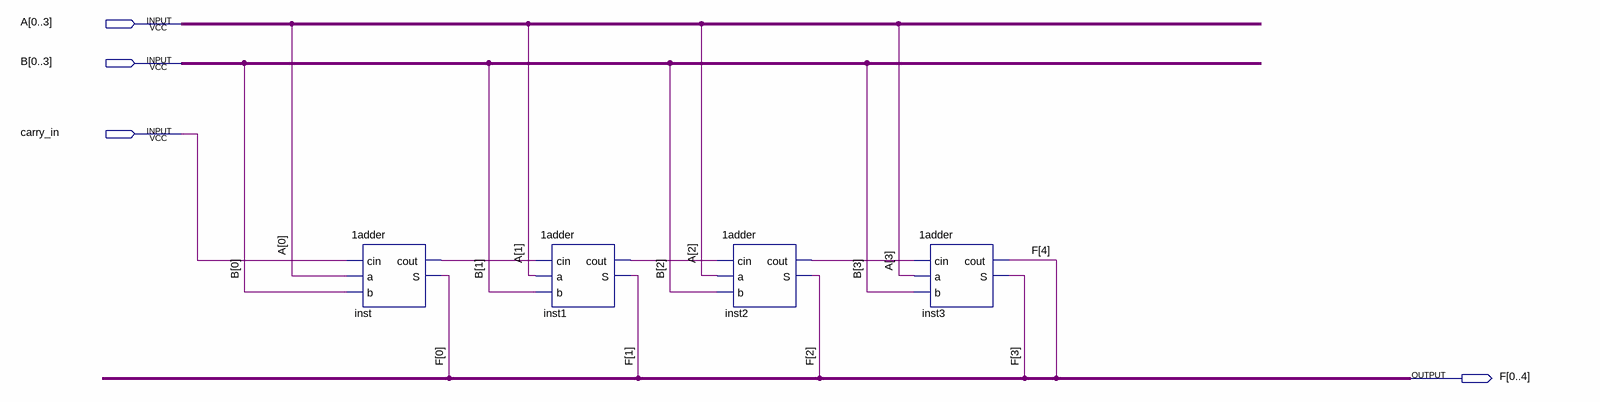
[diagram p0: schematic sheet]
// Quartus schematic 4adder.bdf as structural Verilog: 4 symbols, 4 pins
module \4adder  (
  input  [0:3] A,
  input  [0:3] B,
  input  carry_in,
  output [0:4] F
);

  wire inst1_cout, inst2_cout, inst_cout;

  \1adder  inst (.cin(carry_in), .a(A[0]), .b(B[0]), .cout(inst_cout), .S(F[0]));
  \1adder  inst1 (.cin(inst_cout), .a(A[1]), .b(B[1]), .cout(inst1_cout), .S(F[1]));
  \1adder  inst2 (.cin(inst1_cout), .a(A[2]), .b(B[2]), .cout(inst2_cout), .S(F[2]));
  \1adder  inst3 (.cin(inst2_cout), .a(A[3]), .b(B[3]), .cout(F[4]), .S(F[3]));
endmodule
